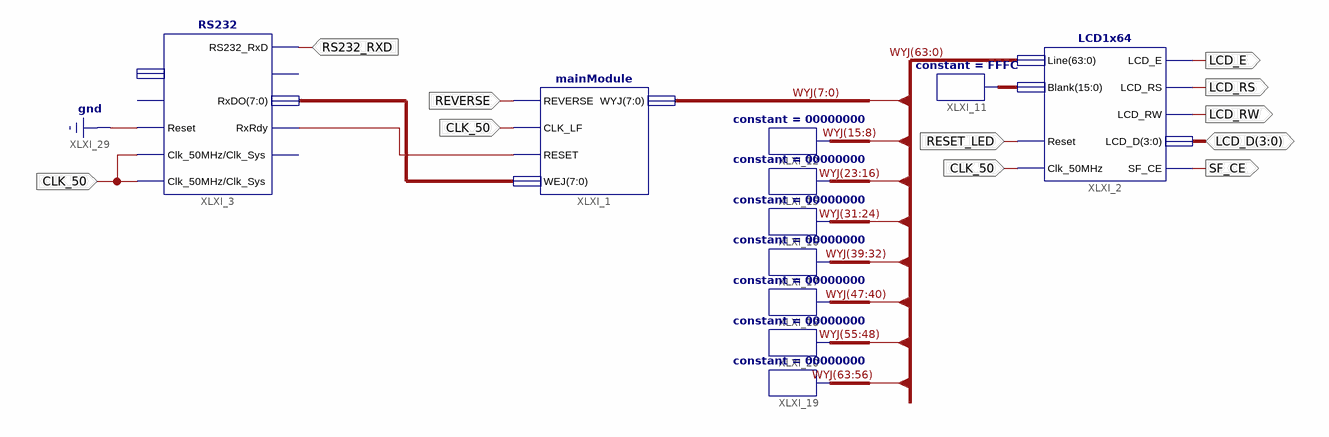
[diagram p0: schematic sheet 1]
// Xilinx ISE schematic scheme_counter.sch (spartan3e) as structural Verilog: 11 symbols, 9 ports
module scheme_counter (
  input  RS232_RXD,
  input  CLK_50,
  input  REVERSE,
  input  RESET_LED,
  inout  [3:0] LCD_D,
  output LCD_E,
  output LCD_RS,
  output LCD_RW,
  output SF_CE
);

  wire XLXN_23;
  wire [7:0] XLXN_22;
  wire [15:0] XLXN_32;
  wire [63:0] WYJ;

  LCD1x64 XLXI_2 (
    .Clk_50MHz(CLK_50), .Reset(RESET_LED), .Line(WYJ), .Blank(XLXN_32), .LCD_D(LCD_D), .LCD_E(LCD_E),
    .LCD_RW(LCD_RW), .LCD_RS(LCD_RS), .SF_CE(SF_CE));
  constant #(.CValue("FFFC")) XLXI_11 (.O(XLXN_32));
  constant #(.CValue("00000000")) XLXI_19 (.O(WYJ[63:56]));
  mainModule XLXI_1 (.REVERSE(REVERSE), .CLK_LF(CLK_50), .RESET(XLXN_23), .WEJ(XLXN_22), .WYJ(WYJ[7:0]));
  RS232 XLXI_3 (
    .Clk_50MHz(CLK_50), .Reset(1'b0), .RS232_RxD(RS232_RXD), .RxRdy(XLXN_23), .RxDO(XLXN_22), .Clk_Sys(CLK_50));  // open: TxStart, TxDI, TxBusy, RS232_TxD
  constant #(.CValue("00000000")) XLXI_15 (.O(WYJ[23:16]));
  constant #(.CValue("00000000")) XLXI_17 (.O(WYJ[39:32]));
  constant #(.CValue("00000000")) XLXI_16 (.O(WYJ[31:24]));
  constant #(.CValue("00000000")) XLXI_18 (.O(WYJ[47:40]));
  constant #(.CValue("00000000")) XLXI_20 (.O(WYJ[55:48]));
  constant #(.CValue("00000000")) XLXI_12 (.O(WYJ[15:8]));
endmodule
